# Altium schematic sheet Power.SchDoc
size A4; SheetNumber: 3; SheetTotal: 6
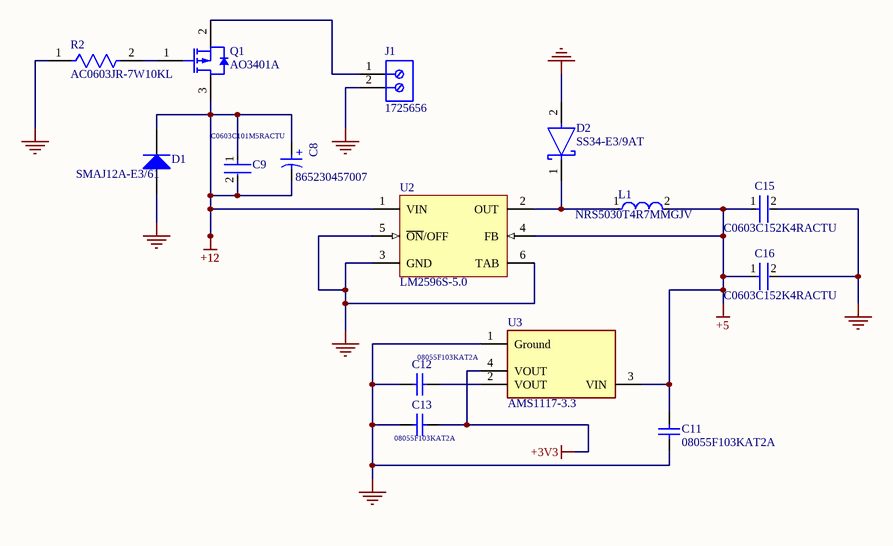
[diagram p0: Power.SchDoc]

## Parts
C8  865230457007  [WCAP-AS5H_D10H10.5]
C9  C0603C101M5RACTU  [FP-C0603C-CF-MFG]
C11  08055F103KAT2A  [CAPC2013X140X50LL20T25]
C12  08055F103KAT2A  [CAPC2013X140X50LL20T25]
C13  08055F103KAT2A  [CAPC2013X140X50LL20T25]
C15  C0603C152K4RACTU  [FP-C0603C-CF-MFG]
C16  C0603C152K4RACTU  [FP-C0603C-CF-MFG]
D1  SMAJ12A-E3/61  [VISH-DO-214AC-2_N]
D2  SS34-E3/9AT  [FP-SMC-MFG]
J1  1725656  [PHOE-1725656-2]
L1  NRS5030T4R7MMGJV  [FP-NRS5030-H_3_1-MFG]
Q1  AO3401A  [AO-SOT-23-3L_V]
R2  AC0603JR-7W10KL  [FP-AC0603-IPC_A]
U2  LM2596S-5.0  [KTT0005B_L]
U3  AMS1117-3.3  [FP-AMS1117-IPC_C]

## Nets
+3V3: C13.1 U3.4(VOUT)
+5: C11.2 C15.1 C16.1 L1.2 U2.4(FB) U3.3(VIN)
+12: C8.1(P) C8.2(N) C9.1 C9.2 D1.1(K) Q1.3(DRAIN) U2.1(VIN)
NetC11_1: C11.1 C12.2 C13.2 C15.2 C16.2 D1.2(A) D2.2(A) J1.2 R2.1 U2.3(GND) U2.5(~{ON}/OFF) U2.6(TAB) U3.1(Ground)
NetC12_1: C12.1 U3.2(VOUT)
NetD2_1: D2.1(C) L1.1 U2.2(OUT)
NetJ1_1: J1.1 Q1.2(SOURCE)
NetQ1_1: Q1.1(GATE) R2.2

## Notes on the sheet
- (in symbol CMP-03913-53914686-2) +

## Library data of the parts
C8 = CMP-03913-53914686-2: WCAP-AS5H Aluminum Electrolytic Capacitors; Life (Hours): 5000hours; Tolerance: 20%; Polarity: Polar; Leakage Current: 55µA; Ripple Current: 240mA; Voltage Rating (DC): 25V; Capacitance: 220µF; Insulation Resistance: 454.545kΩ; Length: 10.5mm; Diameter: 10mm; Mount: Surface Mount; Case/Package: Radial; REACH SVHC: Unknown; Width: 10.3mm; Height: 10.5mm; Min Operating Temperature: -40°C; Height - Seated (Max): 10.4902mm; RoHS: Compliant; Ripple Current (AC): 240mA; Voltage Rating: 25V; Max Operating Temperature: 105°C
C9 = CMP-03020-033322-1: CAP CER 100PF 50V X7R 0603; Manufacturer: KEMET; Description: C0603 100 pF X7R 30ppm/°C 20.00% 50 V; Temperature Coefficient: 30ppm/°C; Tolerance: 0.2; Automotive Grade: Grade 1; Material: Ceramic; ComponentLink2URL: https://api.kemet.com/component-edge/download/datasheet/C0603C100J5GACAUTO.pdf; Device Class L1: Passive Components; Octopart: https://octopart.com/c0603c101m5ractu-kemet-12542883; Voltage Rating: 50 V; Mouser Description: Cap Ceramic 100pF 50V X7R 20% SMD 0603 125°C Punched Paper T/R; Digikey Description: CAP CER 100PF 50V X7R 0603; Temperature Characteristic: X7R; Device Class L2: Capacitors; Automotive: Yes; Value: 100 pF; Package: C0603C-CF; Height: 0.87mm; ComponentLink2Description: Datasheet; Manufacturer Part Number: C0603C101M5RACTU; Device Class L3: Ceramic Capacitors; Temperature Range High: +125°C; Lead Free: Yes; RoHS: TRUE; Capacitance: 100 pF; Category: Cap; Temperature: -55°C to +125°C; Temperature Range Low: -55°C
C11-C13 = CMP-2007-04788-1: Manufacturer: AVX Interconnect / Elco; Part Number: 08055F103KAT2A
C15 C16 = CMP-2006-03092-2: CAP CER 1500PF 16V 10% X7R 0603; Manufacturer: KEMET; Automotive Grade: Grade 1; Capacitance: 1,500 pF; Material: Ceramic; Temperature Coefficient: 30ppm/°C; Description: C0603 1,500 pF X7R 30ppm/°C 10.00% 16 V; Value: 1,500 pF; Tolerance: 0.1; ComponentLink2Description: Datasheet; Device Class L1: Passive Components; Device Class L3: Ceramic Capacitors; Height: 0.87mm; Lead Free: Yes; Mouser Description: Multilayer Ceramic Capacitors MLCC - SMD/SMT 16volts 1500pF X7R 10%; Digikey Description: CAP CER 1500PF 16V 10% X7R 0603; ComponentLink2URL: https://api.kemet.com/component-edge/download/datasheet/C0603C100J5GACAUTO.pdf; Temperature: -55°C to +125°C; Manufacturer Part Number: C0603C152K4RACTU; Temperature Range Low: -55°C; Temperature Range High: +125°C; Package: C0603C-CF; Temperature Characteristic: X7R; Voltage Rating: 16 V; Device Class L2: Capacitors; Octopart: https://octopart.com/c0603c152k4ractu-kemet-12574005; RoHS: TRUE; Automotive: Yes; Category: Cap
D1 = CMP-0544-00020-2: Transient Voltage Suppressor, 6.40 to 231 V, 12 V Stand-off Voltage, Uni-Directional, -55 to 155 degC, 2-pin DO-214AC, Pb-Free, Tape and Reel; Manufacturer: Vishay Semiconductor; PPPM (W): 400, 300; IFSM: 40 A; ID (uA): 1; VBR Uni-Directional (V): 6.4 to 231; VWM (V): 12; Packing: Tape and Reel; RoHS: TRUE; ComponentLink2Description: Datasheet; Operating Junction and Storage Temperature Range: -55 to 150 degC; PackageReference: DO-214AC-2; Mounting Technology: Surface Mount; DatasheetVersion: 12/8/2013; PackageDescription: 2-Pin DO-214AC (SMA), Body 4.245 x 2.665 mm; ComponentLink3URL: http://www.vishay.com/docs/88390/smaj50a.pdf; ComponentLink1URL: http://www.vishay.com/; ComponentLink1Description: Manufacturer URL; ComponentLink3Description: Package Specification; PartNumber: SMAJ12A-E3/61; ComponentLink2URL: http://www.vishay.com/docs/88390/smaj50a.pdf
D2 = CMP-02539-000066-1: DIODE SCHOTTKY 40V 3A DO214AB; Peak Non-Repetitive Surge Current: 100A; Forward Voltage: 500mV; Element Configuration: Single; Max Reverse Current: 500uA; Case/Package: SMC; Radiation Hardening: No; Series: -; Max Surge Current: 100A; RoHS Compliant: Yes; Min Operating Temperature: -55°C; Average Rectified Current: 3A; Max Reverse Leakage Current: 500uA; Package Quantity: 3500; Max Reverse Voltage (DC): 40V; Forward Current: 3A; Packaging: Tape and Reel; Max Operating Temperature: 125°C; Max Repetitive Reverse Voltage (Vrrm): 40V; Number of Pins: 2; Mount: Surface Mount
J1 = CMP-2000-05299-1: Male Header, Pitch 2.54 mm, 1 x 2 Position, Height 9 mm, Tail Length 3.5 mm; Manufacturer: Phoenix Contact; Number of contacts: 2; Content: 250pc(s); Pitch: 2.54mm; Industrial packaging: Yes; Colour: Green; Manufacturer part No.: 1725656; Type: MPT0,5/2-2,54; Datasheet URL: http://datasheet.octopart.com/1725656-Phoenix-Contact-datasheet-5302866.pdf; Manufacturer URL: http://www.phoenixcontact.com/; Datasheet Version: Apr-08
L1 = CMP-14484-000888-1: Inductor Power Shielded Wirewound 4.7uH 20% 100KHz Ferrite 2.6A 45.5mΩ DCR Automotive T/R; Self Resonant Frequency: 31MHz; DC Resistance (DCR): 45.5mR; Saturation Current: 3.1A; Depth: 4.9mm; Width: 0.193inch; Min Operating Temperature: -40°C; Package Quantity: 500; Shielding: Shielded; Tolerance: 20%; Length: 0.193inch; Packaging: Cut Tape; Max Operating Temperature: 125°C; Height - Seated (Max): 0.118inch; Mount: Surface Mount; Ratings: AEC-Q200; Core Material: Ferrite; Current Rating: 2.6A; RoHS Compliant: Yes; Max DC Current: 2.6A; Inductance: 4.7uH; Resistor Type: Wirewound; Test Frequency: 100kHz; Radiation Hardening: No; Case/Package: Nonstandard; Halogen Free: Halogen Free
Q1 = CMP-2000-05778-1: P-Channel MOSFET, 30 V, 4 A, -55 to 150 degC, 3-Pin SOT-23-3L, RoHS, Tape and Reel; Manufacturer: Alpha and Omega; Output Power (Max): NotRequiredW; Power Dissipation: 1.4W; Rad Hardened: No; Drain Efficiency: NotRequired%; Drain-Source On-Volt: 30V; Noise Figure: NotRequireddB; Frequency (Max): NotRequiredMHz; Number of  Elements: 1; Gate-Source Voltage (Max): ?12V; Drain Current (Max): 4A; Channel Mode: Enhancement; Drain-Source On-Res: 0.044ohm; Type: PowerMOSFET; Polarity: P; Package URL: http://www.aosmd.com/res/packaging_information/SOT-23-3L.pdf; Datasheet URL: http://www.aosmd.com/res/data_sheets/AO3401A.pdf; Package Type: SOT-23; Package Description: 3-Pin Small Outline Transistor, Body 2.95 x 1.6 mm, Pitch 0.95 mm; Mounting: SurfaceMount; Manufacturer URL: http://www.aosmd.com/; Continuous Drain Current: 4A; Package Reference: SOT-23-3L; Mounting Technology: SurfaceMount; Operating Temperature Classification: Military; Power Gain: NotRequireddB; Datasheet Version: Rev. 3, 03/2011; Operating Temp Range: -55Cto150C; Pin Count: 3
R2 = CMP-03412-040683-1: RES 10kΩ 5.00% 0.2W 0603
U2 = CMP-0069-00270-3: SIMPLE SWITCHER® Power Converter 150 KHz 3A Step-Down Voltage Regulator, 5-pin TO-263; Manufacturer: Texas Instruments; PowerWise: N; PackageTopMarking: NSUZXYTTE#*LM2596S*-5.0 P+; RoHS: N; Code_JEDEC: MO-169-AB; PackageDescription: TO-263, Molded, .400 x .390 x .180in, 5 Lead, .067in Pitch, Surface Mount; PinCount: 5; PackageReference: KTT0005B; CompType: Switcher; ComponentLink1URL: http://www.ti.com/general/docs/lit/getliterature.tsp?genericPartNumber=LM2596&fileType=pdf; ComponentLink1Description: Datasheet URL
U3 = CMP-209535-000001-1: LDO Voltage Regulators 1A, 3.3V; Manufacturer: Advanced Monolithic Systems; Dropout Voltage: 1.1V; Output Type: Fixed; Nominal Supply Current: 5mA; Max Power Dissipation: 1.2W; Max Supply Voltage: 15V; Number Of Outputs: 1; Standoff Height: 0.64mm; Max Junction Temp: +125°C; Height: 1.8mm; Package: AMS1117; Device Class L2: Power Management ICs; ComponentLink2Description: Datasheet; ComponentLink2URL: http://www.advanced-monolithic.com/pdf/ds1117.pdf; Category: IC; RoHS: TRUE; Automotive: No; Device Class L1: Integrated Circuits (ICs); Output Current: 1A; Device Class L3: Voltage Regulators - Linear; Temperature: -40°C to +125°C; Output Voltage: 3.3V; Manufacturer Part Number: AMS1117-3.3; Temperature Range Low: -40°C; Octopart: https://octopart.com/ams1117-3.3-advanced+monolithic+systems-25899300; Lead Free: Yes; Ipc Land Pattern Name: SOT229P700X180-4; Temperature Range High: +125°C